# Altium schematic sheet fpga_peripherals.SchDoc: FPGA_PERIPHERALS
size A4
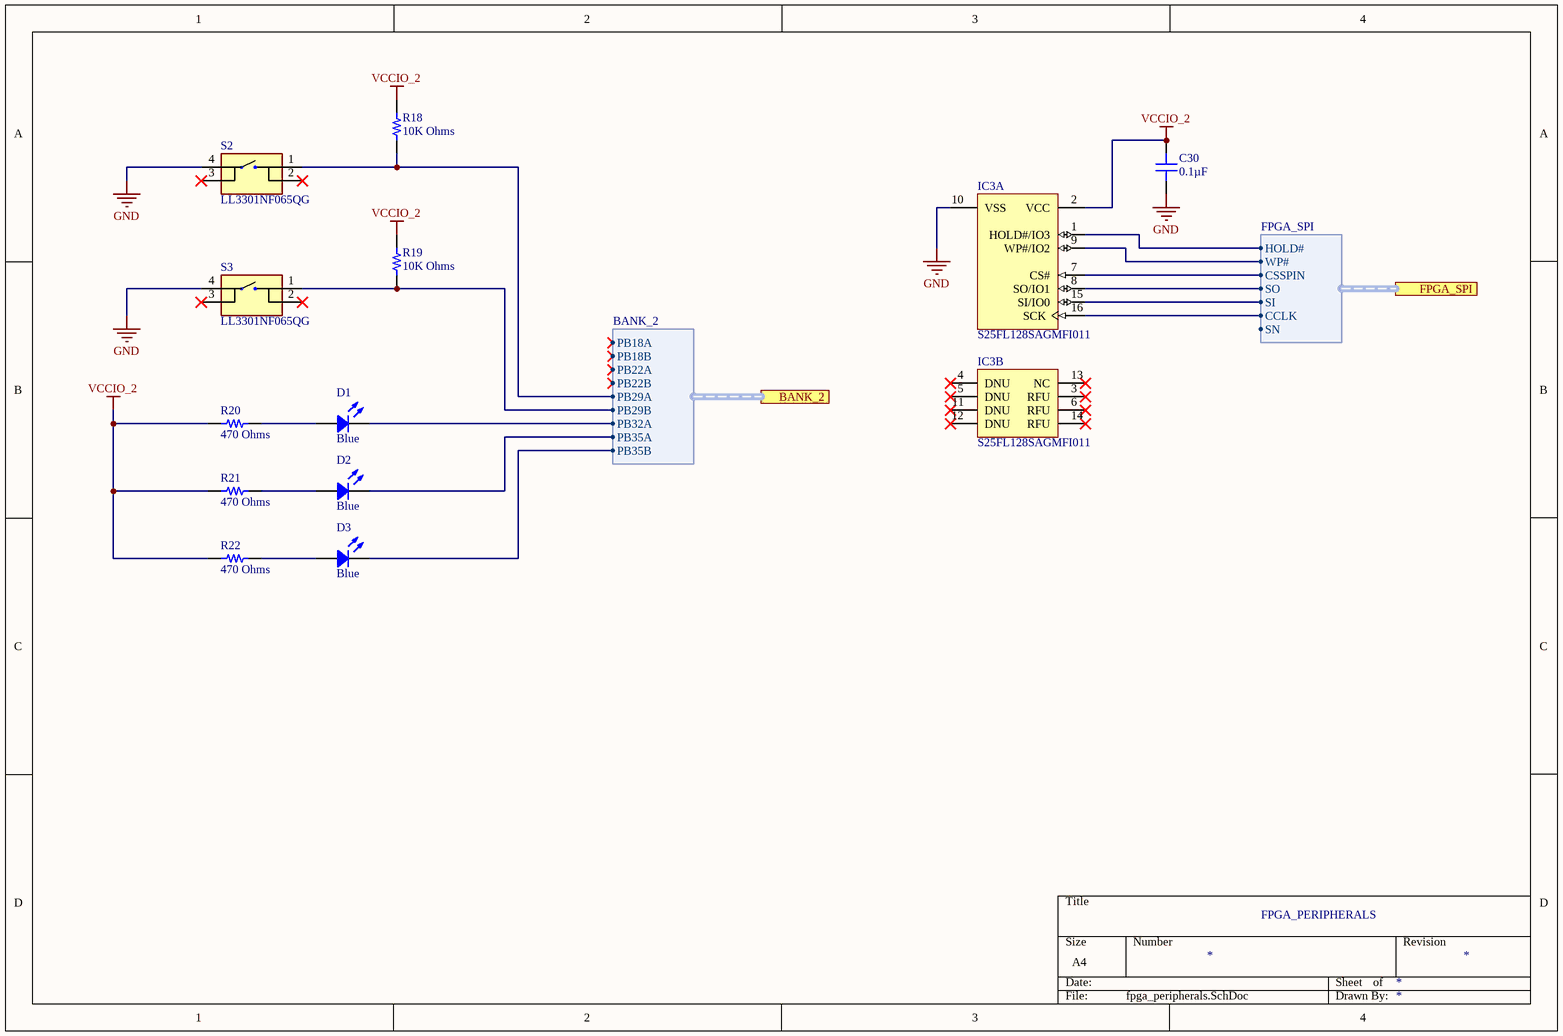
[diagram p0: fpga_peripherals.SchDoc]

## Parts
C30  0.1µF  [CAP 0603_1608]
D1  Blue  [LED 0603_1608 BLUE]
D2  Blue  [LED 0603_1608 BLUE]
D3  Blue  [LED 0603_1608 BLUE]
IC3  S25FL128SAGMFI011  [SPSN-SOIC-16_L]  (parts A,B of 2)
R18  10K Ohms  [RES 0603_1608]
R19  10K Ohms  [RES 0603_1608]
R20  470 Ohms  [RES 0603_1608]
R21  470 Ohms  [RES 0603_1608]
R22  470 Ohms  [RES 0603_1608]
S2  LL3301NF065QG  [LL3301NF065QG]
S3  LL3301NF065QG  [LL3301NF065QG]

## Ports
BANK_2 (harness BANK_2), FPGA_SPI (harness FPGA_SPI)

## Harnesses
FPGA_SPI: CCLK, CSSPIN, HOLD#, SI, SN, SO, WP#
BANK_2: PB18A, PB18B, PB22A, PB22B, PB29A, PB29B, PB32A, PB35A, PB35B

## Nets
GND: C30.1 IC3.10(VSS) S2.4 S3.4
VCCIO_2: C30.2 IC3.2(VCC) R18.2 R19.2 R20.1 R21.1 R22.1
NetD1_1: D1.1 R20.2
NetD1_2: D1.2 ; port BANK_2.PB32A
NetD2_1: D2.1 R21.2
NetD2_2: D2.2 ; port BANK_2.PB35A
NetD3_1: D3.1 R22.2
NetD3_2: D3.2 ; port BANK_2.PB35B
NetIC3_1: IC3.1(HOLD#/IO3) ; port FPGA_SPI.HOLD#
NetIC3_7: IC3.7(CS#) ; port FPGA_SPI.CSSPIN
NetIC3_8: IC3.8(SO/IO1) ; port FPGA_SPI.SO
NetIC3_9: IC3.9(WP#/IO2) ; port FPGA_SPI.WP#
NetIC3_15: IC3.15(SI/IO0) ; port FPGA_SPI.SI
NetIC3_16: IC3.16(SCK) ; port FPGA_SPI.CCLK
NetR18_1: R18.1 S2.1 ; port BANK_2.PB29A
NetR19_1: R19.1 S3.1 ; port BANK_2.PB29B

Not connected (* = marked no-connect by the designer): IC3 3(RFU)* 4(DNU)* 5(DNU)* 6(RFU)* 11(DNU)* 12(DNU)* 13(NC)* 14(RFU)*; S2 2* 3*; S3 2* 3*

## Library data of the parts
C30 = C0603C104K5RAC7411: CAP CER 0.1UF 50V X7R 0603; Manufacturer: KEMET; Tolerance: ±10%; Part Number: C0603C104K5RAC7411; Value: 0.1µF; Applications: Bypass, Decoupling; Capacitance: 0.1µF; ComponentLink1Description: Datasheet; ComponentLink1URL: https://api.kemet.com/component-edge/download/datasheet/C0603C104K5RAC7411.pdf; ComponentLink2Description: DigiKey Link; ComponentLink2URL: http://digikey.com/product-detail/en/kemet/C0603C104K5RAC7411/399-7374-2-ND/3317013; Device Package: 0603 (1608 Metric); LastUpdated: 02.09.2020 1:03:36; Lifecycle Status: Active; Minimum Order: 15000; Mounting Type: Surface Mount, MLCC; Operating Temperature: -55°C ~ 125°C; Package / Case: 0603 (1608 Metric); Packaging: TapeAndReel; PartId: 2233; Part Status: Active; Price: 0.02; Series: SMD Comm X7R; Size / Dimension: 0.063" L x 0.031" W (1.60mm x 0.80mm); Supplier 1: DigiKey; Supplier Part Number 1: 399-7374-2-ND; Temperature Coefficient: X7R; Thickness (Max): 0.035" (0.90mm); Voltage - Rated: 50V
D1-D3 = VLMB1300-GS08: LED BLUE 0603 SMD; Manufacturer: Vishay Semiconductor Opto Division; Configuration: Standard; Current - Test: 20mA; Lens Color: 1.00mm; Lens Size: 1.10mm x 0.80mm; Lens Style: Rectangle with Flat Top; Millicandela Rating: 104mcd; Viewing Angle: 130°; Voltage - Forward (Vf) (Typ): 3.3V; Wavelength - Dominant: 470nm; Wavelength - Peak: 468nm; Part Number: VLMB1300-GS08; Color: Blue; ComponentLink1Description: Datasheet; ComponentLink1URL: http://www.vishay.com/docs/82437/vlmo1300.pdf; ComponentLink2Description: DigiKey Link; ComponentLink2URL: http://digikey.com/product-detail/en/vishay-semiconductor-opto-division/VLMB1300-GS08/VLMB1300-GS08CT-ND/3025485; Device Package: 0603 (1608 Metric); Height (Max): 1.00mm; LastUpdated: 02.09.2020 1:20:26; Lifecycle Status: Active; Minimum Order: 1; Mounting Type: Surface Mount; Package / Case: 0603 (1608 Metric); Packaging: TapeAndReel; PartId: 785; Part Status: Active; Price: 0.08; Series: CHIPLED; Size / Dimension: 1.60mm L x 0.80mm W; Supplier 1: DigiKey; Supplier Part Number 1: VLMB1300-GS08CT-ND; Supplier Device Package: 0603; Value: Blue
IC3 = CMP-1329-00018-1: MirrorBit Flash Non-Volatile Memory CMOS 3.0 Volt Core with Versatile I/O, Serial Peripheral Interface with Multi-I/O, 128 Mbit, 133 MHz, -40 to 85 degC, 16-Pin SO (SO3016), RoHS, Tube; Manufacturer: Spansion; OTP: 1024 B; VCC: 2.7 to 3.6 V; Speed: 133 MHz; PackageDescription: 16-Pin Wide Plastic Small Outline Package, Body 10.3 x 7.5 mm, Pitch 1.27 mm; Density: 128 Mbit; ComponentLink3URL: http://www.spansion.com/Support/Datasheets/S25FL128S_256S_00.pdf; DatasheetVersion: Rev. 08; ComponentLink2Description: Datasheet; ComponentLink3Description: Package Specification; PartNumber: S25FL128SAGMFI011; ComponentLink1Description: Manufacturer URL; ComponentLink1URL: http://www.spansion.com/Pages/Default.aspx; Mounting Technology: Surface Mount; Temperature Range: -40 to 85 degC; ComponentLink2URL: http://www.spansion.com/Support/Datasheets/S25FL128S_256S_00.pdf; RoHS: TRUE; Packing: Tube
R18 R19 = CRCW0603470RJNEAHP: RES SMD 470 OHM 5% 1/4W 0603; Manufacturer: Vishay Dale; Power (Watts): 0.25W, 1/4W; Resistance: 470 Ohms; Temperature Coefficient: ±200ppm/°C; Part Number: CRCW0603470RJNEAHP; Value: 10K Ohms; ComponentLink1Description: Datasheet; ComponentLink1URL: http://www.vishay.com/docs/20043/crcwhpe3.pdf; ComponentLink2Description: DigiKey Link; ComponentLink2URL: http://digikey.com/product-detail/en/vishay-dale/CRCW0603470RJNEAHP/541-470SACT-ND/2222809; Composition: Thick Film; Device Package: 0603 (1608 Metric); Features: Automotive AEC-Q200, Pulse Withstanding; Height - Seated (Max): 0.022" (0.55mm); LastUpdated: 02.09.2020 1:09:49; Lifecycle Status: Active; Minimum Order: 1; Number of Terminations: 2; Operating Temperature: -55°C ~ 155°C; Package / Case: 0603 (1608 Metric); Packaging: TapeAndReel; PartId: 21320; Part Status: Active; Price: 0.02; Ratings: AEC-Q200; Series: CRCW-HP; Size / Dimension: 0.063" L x 0.033" W (1.60mm x 0.85mm); Supplier Device Package: 0603; Tolerance: ±5%; Supplier 1: Farnell; Supplier Part Number 1: 3495224
R20-R22 = CRCW0603470RJNEAHP: RES SMD 470 OHM 5% 1/4W 0603; Manufacturer: Vishay Dale; Power (Watts): 0.25W, 1/4W; Temperature Coefficient: ±200ppm/°C; Part Number: CRCW0603470RJNEAHP; Value: 470 Ohms; ComponentLink1Description: Datasheet; ComponentLink1URL: http://www.vishay.com/docs/20043/crcwhpe3.pdf; ComponentLink2Description: DigiKey Link; ComponentLink2URL: http://digikey.com/product-detail/en/vishay-dale/CRCW0603470RJNEAHP/541-470SACT-ND/2222809; Composition: Thick Film; Device Package: 0603 (1608 Metric); Features: Automotive AEC-Q200, Pulse Withstanding; Height - Seated (Max): 0.022" (0.55mm); LastUpdated: 02.09.2020 1:09:49; Lifecycle Status: Active; Minimum Order: 1; Number of Terminations: 2; Operating Temperature: -55°C ~ 155°C; Package / Case: 0603 (1608 Metric); Packaging: TapeAndReel; PartId: 21320; Part Status: Active; Price: 0.02; Ratings: AEC-Q200; Resistance: 470 Ohms; Series: CRCW-HP; Size / Dimension: 0.063" L x 0.033" W (1.60mm x 0.85mm); Supplier 1: DigiKey; Supplier Part Number 1: 541-470SACT-ND; Supplier Device Package: 0603; Tolerance: ±5%
S2 S3 = LL3301NF065QG: Switch; Manufacturer_Name: E-Switch; Datasheet Link: http://spec_sheets.e-switch.com/specs/P090002.pdf; Height: 4mm; Manufacturer_Part_Number: LL3301NF065QG; Mouser Part Number: 612-LL3301NF065QG; Mouser Price/Stock: https://www.mouser.co.uk/ProductDetail/E-Switch/LL3301NF065QG/?qs=QtyuwXswaQiWhwgY68YTTw%3D%3D